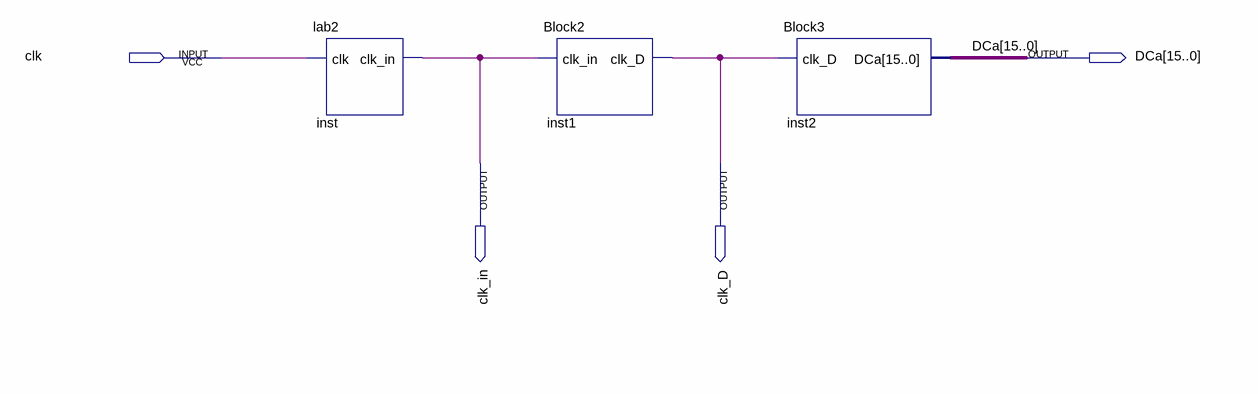
[diagram p0: schematic sheet]
// Quartus schematic main.bdf as structural Verilog: 3 symbols, 4 pins
module main (
  input  clk,
  output [15:0] DCa,
  output clk_in,
  output clk_D
);

  lab2 inst (.clk(clk), .clk_in(clk_in));
  Block2 inst1 (.clk_in(clk_in), .clk_D(clk_D));
  Block3 inst2 (.clk_D(clk_D), .DCa(DCa));
endmodule
